# EAGLE design brick_seriak_zigbee (EAGLE 7.2.0)
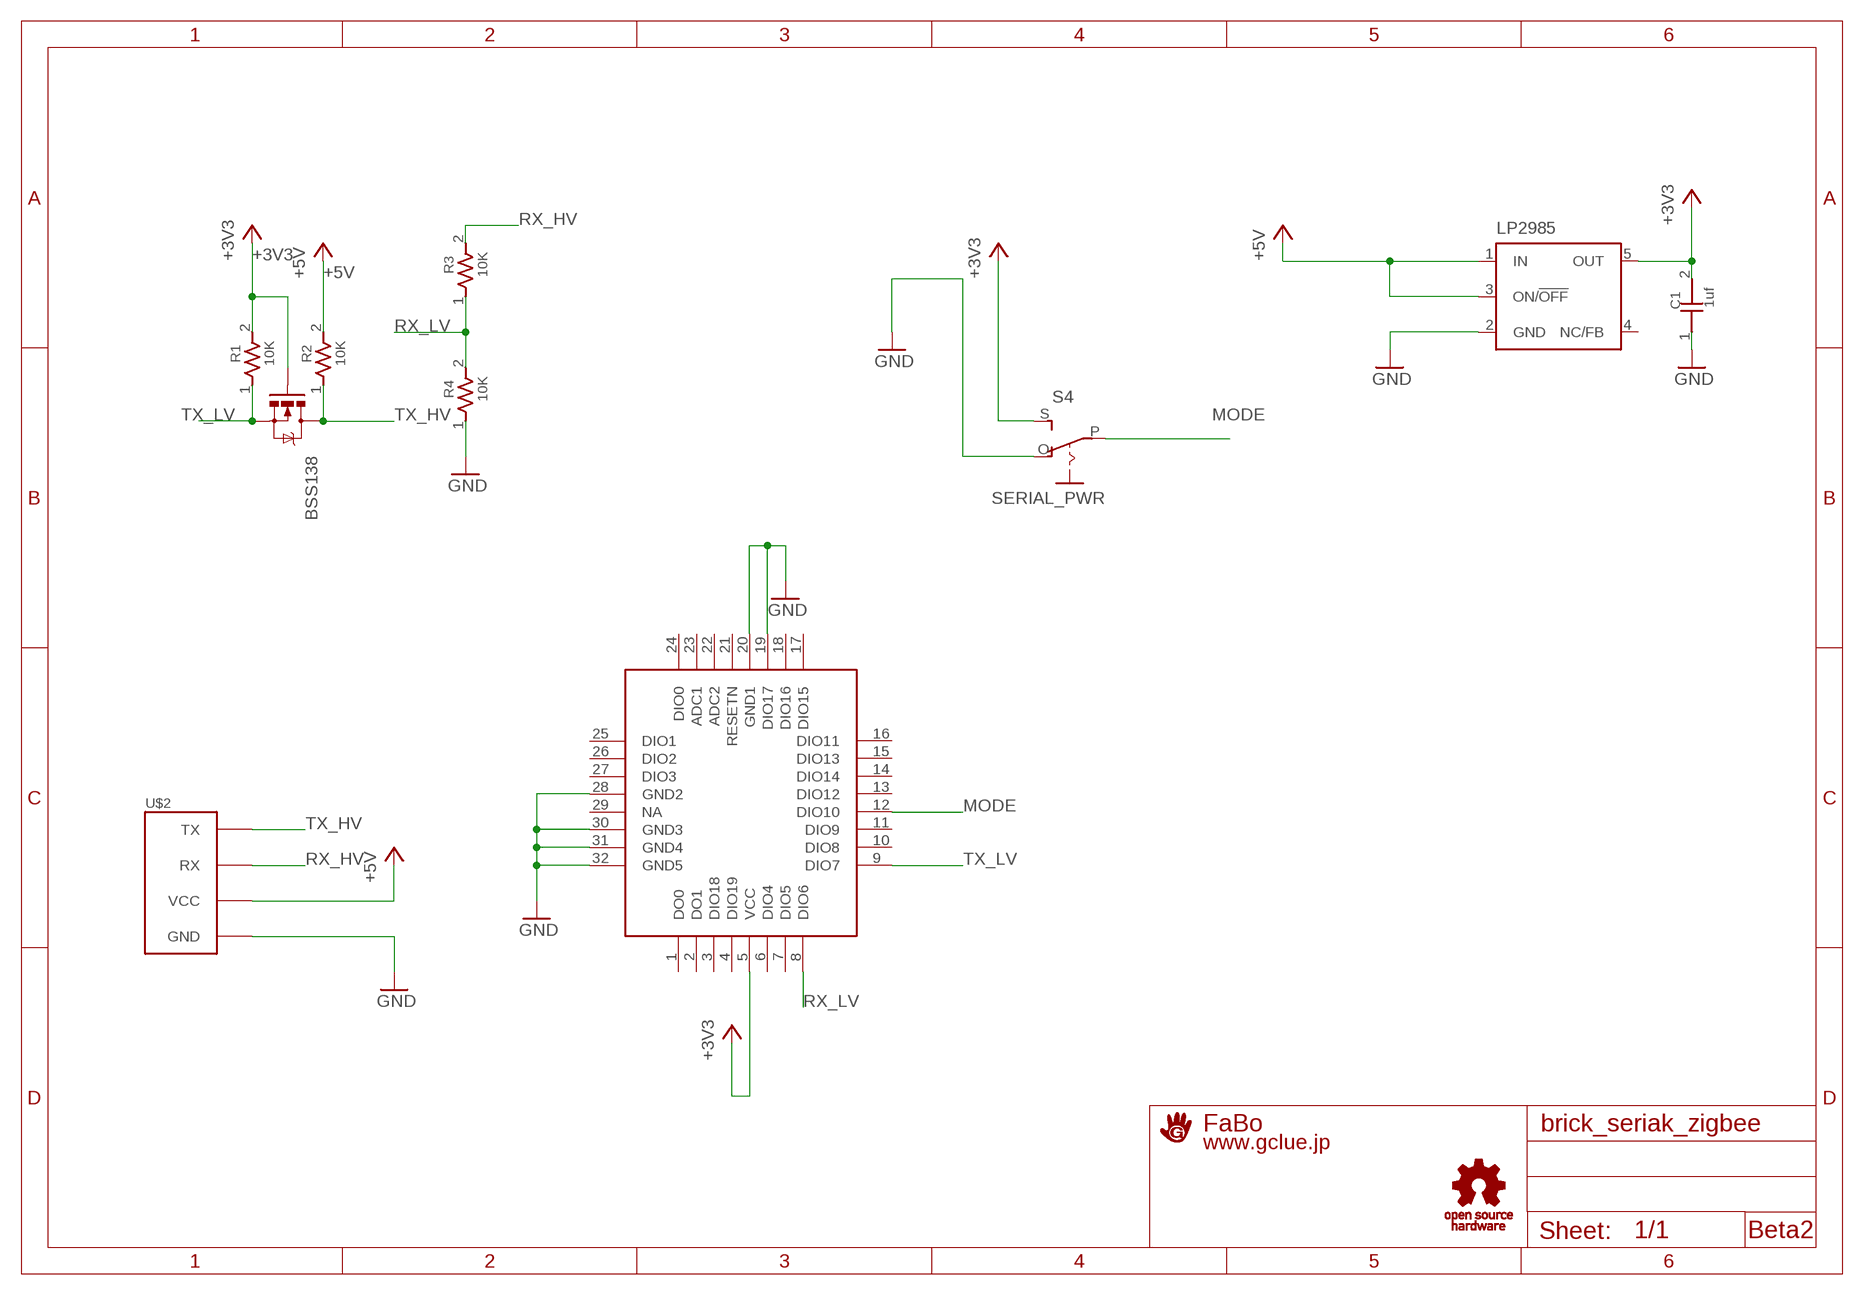
[diagram p0: schematic, sheet 1]

## Parts
BSS138  MOSFET-NCHANNELSMD  [SOT23-3]
C1  1uf  CAPACITOR0603  [0603]
LP2985  LP2985-XXDBVR33  [SOT23-DBV]
R1  10K  RESISTOR0603  [0603]
R2  10K  RESISTOR0603  [0603]
R3  10K  RESISTOR0603  [0603]
R4  10K  RESISTOR0603  [0603]
S4  SERIAL_PWR  EG1218S  [EG1218]
U$1  A4L-LOC-FABO_S  [LOGO_FABO_S]
U$2  BRICK_SERIAL  [BRICK_SERIAL]
U$3  TOCOS-TWE001L  [TOCOS-TWE001L]
U$5  LOGO_OSHW_T-S  [LOGO_OSHW_T_S]

## Nets
+3V3: BSS138.1(G) C1.2 LP2985.5(OUT) R1.2 S4.S U$3.5(VCC)
+5V: LP2985.1(IN) LP2985.3(ON/!OFF) R2.2 U$2.VCC
GND: C1.1 LP2985.2(GND) R4.1 S4.O U$2.GND U$3.19(DIO17) U$3.20(GND1) U$3.28(GND2) U$3.30(GND3) U$3.31(GND4) U$3.32(GND5)
MODE: S4.P U$3.12(DIO10)
RX_HV: R3.2 U$2.RX
RX_LV: R3.1 R4.2 U$3.8(DIO6)
TX_HV: BSS138.3(D) R2.1 U$2.TX
TX_LV: BSS138.2(S) R1.1 U$3.9(DIO7)
Unconnected: LP2985.4(NC/FB) U$3.1(DO0) U$3.2(DO1) U$3.3(DIO18) U$3.4(DIO19) U$3.6(DIO4) U$3.7(DIO5) U$3.10(DIO8) U$3.11(DIO9) U$3.13(DIO12) U$3.14(DIO14) U$3.15(DIO13) U$3.16(DIO11) U$3.17(DIO15) U$3.18(DIO16) U$3.21(RESETN) U$3.22(ADC2) U$3.23(ADC1) U$3.24(DIO0) U$3.25(DIO1) U$3.26(DIO2) U$3.27(DIO3) U$3.29(NA)

## Notes on the sheet
- Beta2

## Library data of the parts
BSS138 = SparkFun:MOSFET-NCHANNEL
C1 = GClue-Capacitor:CAPACITOR
LP2985 = SmartPrj:LP2985-XXDBVR: ULTRALOW-POWER 50-mA LOW-DROPOUT LINEAR REGULATORS 50-mA Low-Dropout Regulator Source: http://focus.ti.com/lit/ds/symlink/tps77001.pdf
R1-R4 = GClue-Resistors:RESISTOR
S4 = adafruit:EG1218: SLIDING SWITCH 0.1" spacing through hole, vertical SPDT slide switch http://www.ladyada.net/library/pcb/eaglelibrary.html
U$1 = gclue:A4L-LOC: FaBo A4 FRAME
U$2 = gclue:BRICK_SERIAL: FaBo Brick 4pin(SERIAL)
U$3 = gclueZigbee:TOCOS-TWE001L
U$5 = gclue:LOGO_OSHW_T

## Net classes
0 default: clearance 0.254 mm

## Board
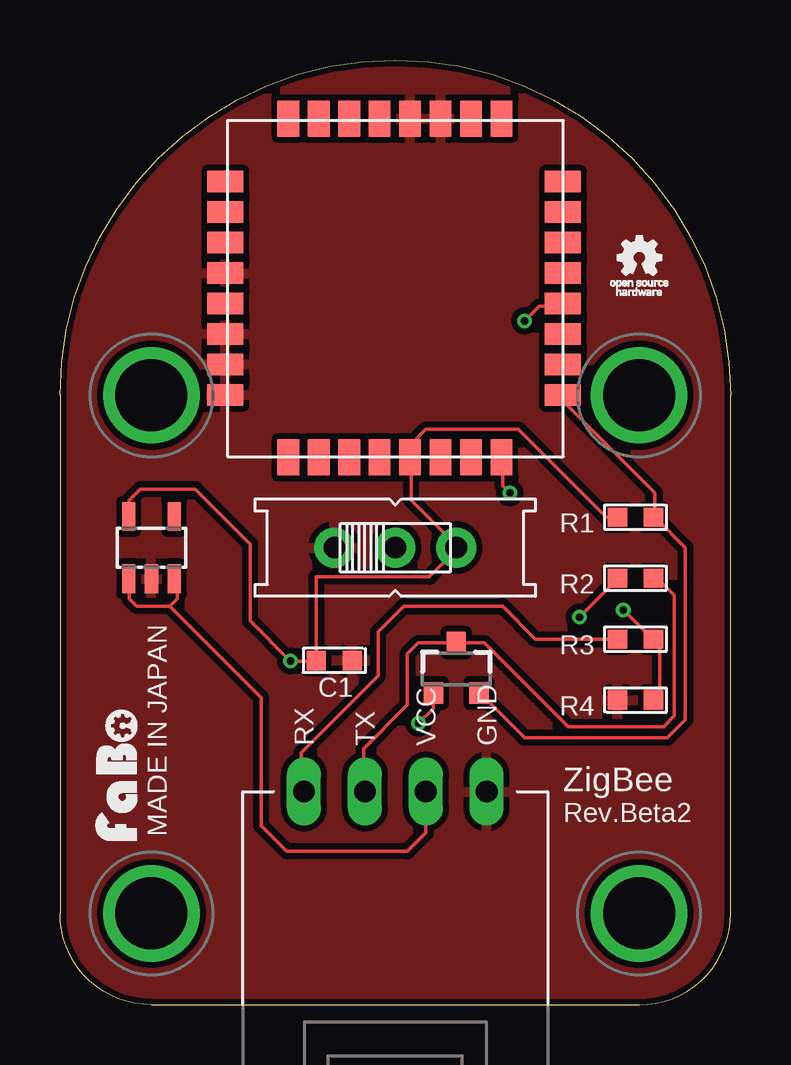
[diagram p1: board, top side]
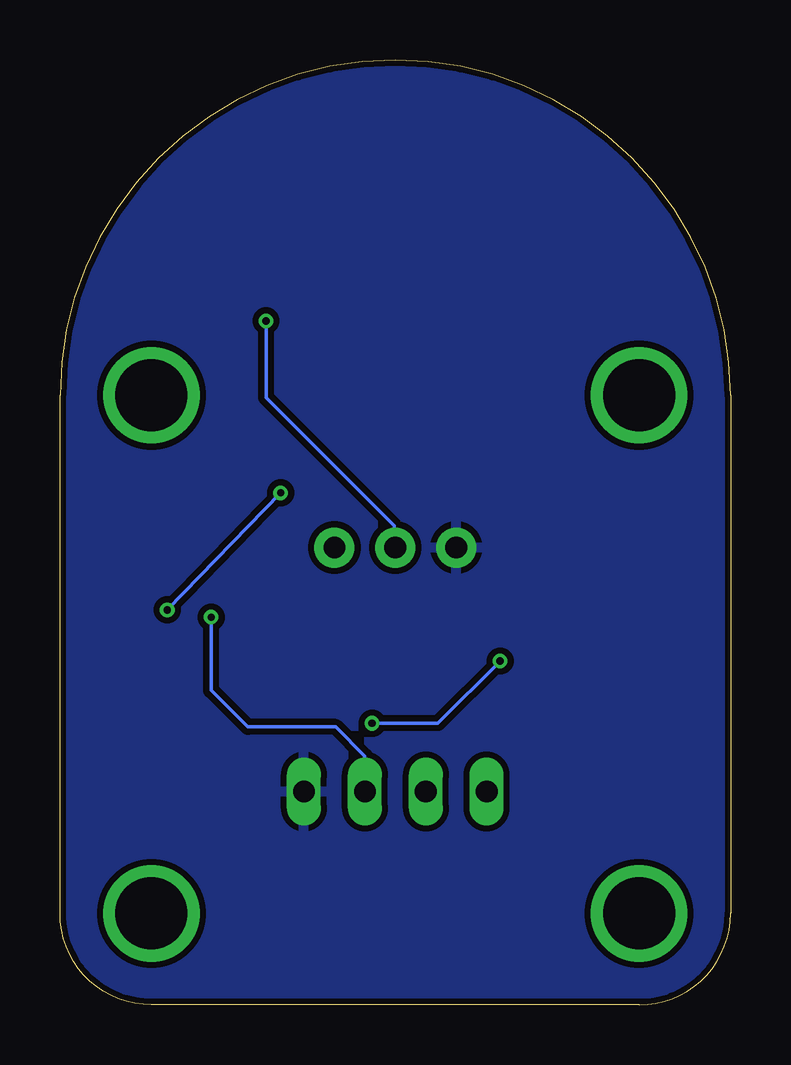
[diagram p2: board, bottom side, seen from below]

Size 27.94 x 39.37 mm. Coordinates in mm from the lower left corner, seen from the top.
Copper layers (1*16): Top 0.035mm / dielectric 1.5mm / Bottom 0.035mm
Design rules "Elecrow_2-layer_eagle_rule": minimum track width 6mil, minimum drill 12mil, track to track 6mil, track to pad 6mil, pad to pad 6mil, via to via 6mil, smd to smd 0mil, copper to edge 10mil, drill to drill 10mil, minimum pad ring 10mil, minimum via ring 6mil, stop-mask expansion 2mil, vias tented up to drill 100mil, thermal gap 10mil

### Footprints (pad centres in the part's own frame; a part is rotated, then mirrored left to right if it is on the bottom)
SOT23-3 = smd 0.8 x 0.9: 1 -0.95,-1; 2 0.95,-1; 3 0,1.1
0603 = smd 0.8 x 0.8: 1 -0.75,0; 2 0.75,0
SOT23-DBV = smd 0.55 x 1.2: 1 -0.95,-1.3; 2 0,-1.3; 3 0.95,-1.3; 4 0.95,1.3; 5 -0.95,1.3
EG1218 = drill 0.9 pad 1.676: O -2.54,0; P 0,0; S 2.54,0
BRICK_SERIAL = drill 0.9 long: GND 3.81,-10.16; RX -3.81,-10.16; TX -1.27,-10.16; VCC 1.27,-10.16 | drill 3 pad 3.81: P$5 -10.16,6.35; P$6 10.16,6.35; P$7 -10.16,-15.24; P$8 10.16,-15.24
TOCOS-TWE001L = smd 0.9 x 1.5: 1 -4.46,-7.03; 2 -3.19,-7.03; 3 -1.92,-7.03; 4 -0.65,-7.03; 5 0.62,-7.03; 6 1.89,-7.03; 7 3.16,-7.03; 8 4.43,-7.03; 17 4.43,7.08; 18 3.16,7.08; 19 1.89,7.08; 20 0.62,7.08; 21 -0.65,7.08; 22 -1.92,7.08; 23 -3.19,7.08; 24 -4.46,7.08 | smd 1.5 x 0.9: 9 6.98,-4.43; 10 6.98,-3.16; 11 6.98,-1.89; 12 6.98,-0.62; 13 6.98,0.65; 14 6.98,1.92; 15 6.98,3.19; 16 6.98,4.46; 25 -7.08,4.46; 26 -7.08,3.19; 27 -7.08,1.92; 28 -7.08,0.65; 29 -7.08,-0.62; 30 -7.08,-1.89; 31 -7.08,-3.16; 32 -7.08,-4.43

### Placement (x,y rotation side)
BSS138  16.51,14 0 top
C1  11.43,14.35 180 top
LP2985  3.81,19.05 0 top
R1  23.98,20.32 180 top
R2  23.98,17.78 180 top
R3  23.98,15.24 180 top
R4  23.98,12.7 0 top
S4  13.97,19.05 0 top
U$2  13.97,19.05 0 top
U$3  13.97,29.84 0 top
U$4  [LOGO_FABO_S]  3.23,9.63 90 top
U$5  24.13,31.11 0 top

### Tracks (layer width: path | path; a pad name or v marks a point on that pad's centre or on a via)
+3V3  (via drill 0.3)
  Top 0.152: R1.2 22.76,20.32 19.1,23.98 15.24,23.98 14.63,23.37 14.63,22.96 U$3.5 14.63,22.76 14.63,21.03 16.46,19.2 S4.S 16.46,18.9 15.39,17.83 10.67,17.83 C1.2 10.67,14.33 v9.6,14.33 7.92,16 7.92,19.2 5.64,21.49 3.35,21.49 2.9,21.03 2.9,20.42 LP2985.5 | v14.94,11.73 15.54,12.34 15.54,12.95 15.56,12.97 BSS138.1
  Bottom 0.152: v14.94,11.73 12.19,11.73 v9.6,14.33
+5V  (via drill 0.3)
  Top 0.152: 4.57,16.61 3.2,16.61 2.9,16.92 2.9,17.68 LP2985.1 | 4.57,16.61 4.88,16.92 4.88,17.68 LP2985.3 | v21.64,16.15 23.16,17.68 R2.2 | 4.57,16.61 8.38,12.8 8.38,7.47 9.45,6.4 14.48,6.4 15.24,7.16 U$2.VCC
  Bottom 0.152: v21.64,16.15 21.64,13.11 20.12,11.58 16.46,11.58 15.24,10.36 U$2.VCC
GND
  pour Bottom: -1.27,-1.27 29.21,-1.27 29.21,40.64 -1.27,40.64
  pour Top: -1.27,-1.27 29.21,-1.27 29.21,40.64 -1.27,40.64
MODE  (via drill 0.3)
  Top 0.152: v19.36,28.5 19.96,29.11 20.88,29.11 U$3.12
  Bottom 0.152: v19.36,28.5 19.36,25.3 14.02,19.96 14.02,19.05 S4.P
RX_HV
  Top 0.152: R3.2 19.81,15.24 18.44,16.61 14.33,16.61 13.26,15.54 13.26,13.72 10.06,10.52 10.06,8.99 U$2.RX
RX_LV  (via drill 0.3)
  Top 0.152: R4.2 24.99,12.8 24.99,15.24 R3.1 24.69,15.24 v23.47,16.46 | v18.75,21.34 18.44,21.64 18.44,22.71 U$3.8
  Bottom 0.152: v23.47,16.46 v18.75,21.34
TX_HV
  Top 0.152: R2.1 24.99,17.68 25.6,17.07 25.6,12.04 25.15,11.58 21.18,11.58 17.68,15.09 16.76,15.09 16.61,15.24 BSS138.3 16.45,15.1 16.31,15.09 14.94,15.09 14.48,14.63 14.48,12.5 12.65,10.67 12.65,8.99 U$2.TX
TX_LV
  Top 0.152: U$3.9 21.13,25.4 21.13,24.99 24.79,21.34 24.79,20.32 R1.1 24.84,20.27 26.06,19.05 26.06,11.89 25.3,11.12 19.36,11.12 17.53,12.95 BSS138.2

### Text on the board
tPlace: MADE IN JAPAN | ZigBee | Rev.Beta2